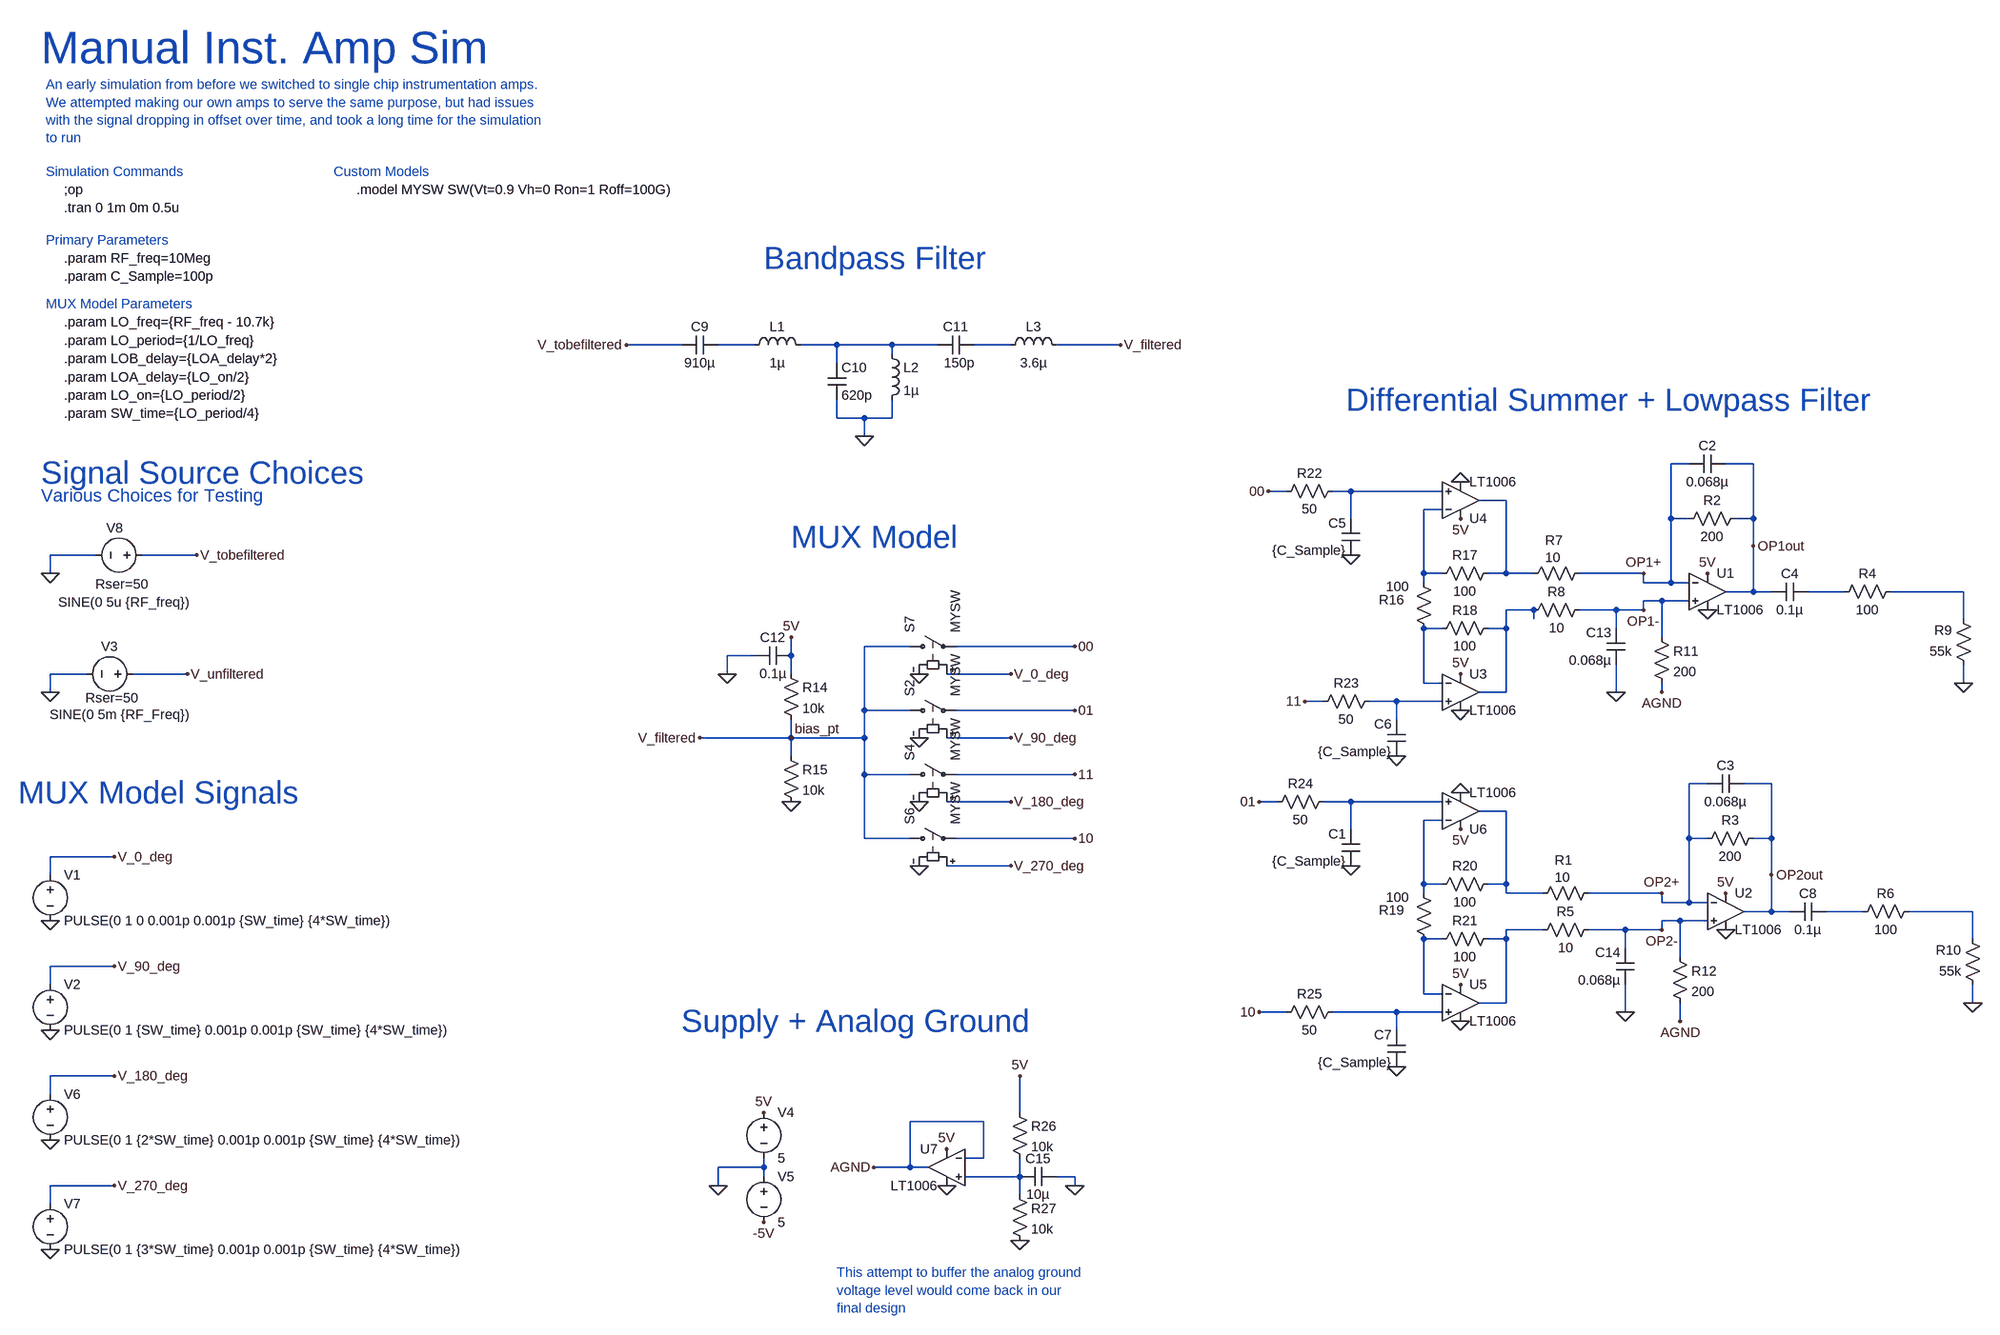
[diagram p0: schematic OldReceiverDesign.asc]
OldReceiverDesign.asc, the LTspice schematic file:
Version 4
SHEET 1 2720 2156
WIRE -192 -752 -288 -752
WIRE -64 -752 -128 -752
WIRE 80 -752 16 -752
WIRE 176 -752 80 -752
WIRE 256 -752 176 -752
WIRE 384 -752 320 -752
WIRE 576 -752 464 -752
WIRE 176 -736 176 -752
WIRE 80 -720 80 -752
WIRE 80 -624 80 -656
WIRE 128 -624 80 -624
WIRE 176 -624 176 -656
WIRE 176 -624 128 -624
WIRE 128 -592 128 -624
WIRE 1664 -544 1632 -544
WIRE 1776 -544 1728 -544
WIRE 960 -496 928 -496
WIRE 1072 -496 1040 -496
WIRE 1232 -496 1072 -496
WIRE 1344 -480 1296 -480
WIRE 1232 -464 1200 -464
WIRE 1072 -448 1072 -496
WIRE 1632 -448 1632 -544
WIRE 1664 -448 1632 -448
WIRE 1776 -448 1776 -544
WIRE 1776 -448 1744 -448
WIRE 1776 -400 1776 -448
WIRE -1216 -384 -1296 -384
WIRE -1040 -384 -1136 -384
WIRE -1296 -352 -1296 -384
WIRE 1200 -352 1200 -464
WIRE 1232 -352 1200 -352
WIRE 1344 -352 1344 -480
WIRE 1344 -352 1312 -352
WIRE 1392 -352 1344 -352
WIRE 1584 -352 1472 -352
WIRE 1200 -336 1200 -352
WIRE 1584 -336 1584 -352
WIRE 1632 -336 1632 -448
WIRE 1632 -336 1584 -336
WIRE 1664 -336 1632 -336
WIRE 1776 -320 1776 -400
WIRE 1776 -320 1728 -320
WIRE 1808 -320 1776 -320
WIRE 1936 -320 1872 -320
WIRE 2144 -320 2016 -320
WIRE 1616 -304 1584 -304
WIRE 1664 -304 1616 -304
WIRE 1392 -288 1344 -288
WIRE 1536 -288 1472 -288
WIRE 1584 -288 1584 -304
WIRE 1584 -288 1536 -288
WIRE 1392 -272 1392 -288
WIRE 2144 -272 2144 -320
WIRE 1232 -256 1200 -256
WIRE 1344 -256 1344 -288
WIRE 1344 -256 1312 -256
WIRE 1536 -256 1536 -288
WIRE 1616 -240 1616 -304
WIRE 208 -224 128 -224
WIRE 496 -224 288 -224
WIRE -64 -208 -112 -208
WIRE 0 -208 0 -240
WIRE -1232 -176 -1296 -176
WIRE -1056 -176 -1152 -176
WIRE -112 -176 -112 -208
WIRE 0 -176 0 -208
WIRE 384 -176 272 -176
WIRE 1200 -160 1200 -256
WIRE 1232 -160 1200 -160
WIRE 2144 -160 2144 -192
WIRE -1296 -144 -1296 -176
WIRE 1344 -144 1344 -256
WIRE 1344 -144 1296 -144
WIRE 1536 -144 1536 -192
WIRE 1616 -144 1616 -160
WIRE 1024 -128 992 -128
WIRE 1152 -128 1104 -128
WIRE 1232 -128 1152 -128
WIRE 128 -112 128 -224
WIRE 208 -112 128 -112
WIRE 496 -112 288 -112
WIRE 1152 -96 1152 -128
WIRE 0 -64 0 -96
WIRE 0 -64 -160 -64
WIRE 128 -64 128 -112
WIRE 128 -64 0 -64
WIRE 384 -64 272 -64
WIRE 0 -32 0 -64
WIRE 128 0 128 -64
WIRE 208 0 128 0
WIRE 496 0 288 0
WIRE 1696 16 1664 16
WIRE 1808 16 1760 16
WIRE 384 48 272 48
WIRE 944 48 912 48
WIRE 1072 48 1024 48
WIRE 1232 48 1072 48
WIRE 1344 64 1296 64
WIRE 1232 80 1200 80
WIRE 1072 96 1072 48
WIRE 128 112 128 0
WIRE 208 112 128 112
WIRE 496 112 288 112
WIRE 1664 112 1664 16
WIRE 1696 112 1664 112
WIRE 1808 112 1808 16
WIRE 1808 112 1776 112
WIRE -1184 144 -1296 144
WIRE 384 160 272 160
WIRE -1296 176 -1296 144
WIRE 1808 176 1808 112
WIRE 1200 192 1200 80
WIRE 1232 192 1200 192
WIRE 1344 192 1344 64
WIRE 1344 192 1312 192
WIRE 1200 208 1200 192
WIRE 1344 208 1344 192
WIRE 1408 208 1344 208
WIRE 1616 208 1488 208
WIRE 1616 224 1616 208
WIRE 1664 224 1664 112
WIRE 1664 224 1616 224
WIRE 1696 224 1664 224
WIRE 1808 240 1808 176
WIRE 1808 240 1760 240
WIRE 1840 240 1808 240
WIRE 1968 240 1904 240
WIRE 2160 240 2048 240
WIRE 1648 256 1616 256
WIRE 1696 256 1648 256
WIRE 1408 272 1344 272
WIRE 1552 272 1488 272
WIRE 1616 272 1616 256
WIRE 1616 272 1552 272
WIRE 1232 288 1200 288
WIRE 1344 288 1344 272
WIRE 1344 288 1312 288
WIRE 2160 288 2160 240
WIRE 1552 304 1552 272
WIRE 1648 320 1648 256
WIRE -1184 336 -1296 336
WIRE -1296 368 -1296 336
WIRE 1200 384 1200 288
WIRE 1232 384 1200 384
WIRE 1344 400 1344 288
WIRE 1344 400 1296 400
WIRE 2160 400 2160 368
WIRE 960 416 912 416
WIRE 1152 416 1040 416
WIRE 1232 416 1152 416
WIRE 1552 416 1552 368
WIRE 1648 432 1648 400
WIRE 1152 448 1152 416
WIRE -1184 528 -1296 528
WIRE -1296 560 -1296 528
WIRE 400 592 400 528
WIRE 336 608 208 608
WIRE 336 672 336 608
WIRE 336 672 304 672
WIRE -48 688 -48 672
WIRE -48 688 -128 688
WIRE 208 688 208 608
WIRE 208 688 144 688
WIRE 240 688 208 688
WIRE -48 704 -48 688
WIRE 400 704 400 672
WIRE 400 704 304 704
WIRE 496 704 464 704
WIRE -1184 720 -1296 720
WIRE -128 720 -128 688
WIRE 496 720 496 704
WIRE 400 736 400 704
WIRE -1296 752 -1296 720
FLAG 224 -176 0
FLAG 224 -64 0
FLAG 224 48 0
FLAG 224 160 0
FLAG -1296 -144 0
FLAG -48 592 5V
FLAG 1152 -32 0
FLAG 1072 -384 0
FLAG 1584 -352 OP1+
FLAG 1616 272 OP2-
FLAG 1584 -288 OP1-
FLAG 1776 -400 OP1out
FLAG 1808 176 OP2out
FLAG 1616 208 OP2+
FLAG 2144 -160 0
FLAG 2160 400 0
FLAG -128 720 0
FLAG -48 784 -5V
FLAG 384 -176 V_0_deg
FLAG 384 -64 V_90_deg
FLAG 384 48 V_180_deg
FLAG 384 160 V_270_deg
FLAG -1296 256 0
FLAG -1184 144 V_0_deg
FLAG -1296 448 0
FLAG -1184 336 V_90_deg
FLAG -1296 640 0
FLAG -1184 528 V_180_deg
FLAG -1296 832 0
FLAG -1184 720 V_270_deg
FLAG 496 -224 00
FLAG 496 0 11
FLAG 928 -496 00
FLAG 992 -128 11
FLAG -1296 -352 0
FLAG 128 -592 0
FLAG 576 -752 V_filtered
FLAG -1056 -176 V_unfiltered
FLAG -160 -64 V_filtered
FLAG 0 -240 5V
FLAG 0 48 0
FLAG 0 -64 bias_pt
FLAG -112 -176 0
FLAG 1696 -288 0
FLAG 1696 -352 5V
FLAG 1264 -448 5V
FLAG 1264 -512 0
FLAG 1264 -112 0
FLAG 1264 -176 5V
FLAG 1152 512 0
FLAG 1072 160 0
FLAG 912 48 01
FLAG 912 416 10
FLAG 1264 96 5V
FLAG 1264 32 0
FLAG 1264 432 0
FLAG 1264 368 5V
FLAG 496 -112 01
FLAG 496 112 10
FLAG 1536 -144 0
FLAG 1552 416 0
FLAG 1728 272 0
FLAG 1728 208 5V
FLAG 400 528 5V
FLAG 400 816 0
FLAG 496 720 0
FLAG 144 688 AGND
FLAG 1616 -144 AGND
FLAG 1648 432 AGND
FLAG 272 720 0
FLAG 272 656 5V
FLAG -1040 -384 V_tobefiltered
FLAG -288 -752 V_tobefiltered
SYMBOL sw 192 -224 R270
SYMATTR InstName S7
SYMATTR Value MYSW
SYMBOL sw 192 -112 R270
SYMATTR InstName S2
SYMATTR Value MYSW
SYMBOL sw 192 0 R270
SYMATTR InstName S4
SYMATTR Value MYSW
SYMBOL sw 192 112 R270
SYMATTR InstName S6
SYMATTR Value MYSW
SYMBOL voltage -1136 -176 R90
WINDOW 0 -32 56 VBottom 2
WINDOW 3 56 38 VTop 2
WINDOW 123 0 0 Left 0
WINDOW 39 58 52 VBottom 2
SYMATTR InstName V3
SYMATTR Value SINE(0 5m {RF_Freq})
SYMATTR SpiceLine Rser=50
SYMBOL voltage -48 576 R0
WINDOW 123 0 0 Left 0
WINDOW 39 0 0 Left 0
SYMATTR InstName V4
SYMATTR Value 5
SYMBOL cap 1088 -384 R180
WINDOW 0 24 56 Left 2
WINDOW 3 24 8 Left 2
SYMATTR InstName C5
SYMATTR Value {C_Sample}
SYMBOL cap 1168 -32 R180
WINDOW 0 24 56 Left 2
WINDOW 3 24 8 Left 2
SYMATTR InstName C6
SYMATTR Value {C_Sample}
SYMBOL res 1376 -336 R270
WINDOW 0 58 52 VTop 2
WINDOW 3 59 50 VBottom 2
SYMATTR InstName R7
SYMATTR Value 10
SYMBOL res 1488 -304 R90
WINDOW 0 0 56 VBottom 2
WINDOW 3 32 56 VTop 2
SYMATTR InstName R8
SYMATTR Value 10
SYMBOL res 1760 -464 R90
WINDOW 0 0 56 VBottom 2
WINDOW 3 32 56 VTop 2
SYMATTR InstName R2
SYMATTR Value 200
SYMBOL cap 1728 -560 R90
WINDOW 0 0 32 VBottom 2
WINDOW 3 32 32 VTop 2
SYMATTR InstName C2
SYMATTR Value 0.068µ
SYMBOL res 1792 96 R90
WINDOW 0 0 56 VBottom 2
WINDOW 3 32 56 VTop 2
SYMATTR InstName R3
SYMATTR Value 200
SYMBOL cap 1760 0 R90
WINDOW 0 0 32 VBottom 2
WINDOW 3 32 32 VTop 2
SYMATTR InstName C3
SYMATTR Value 0.068µ
SYMBOL cap 1872 -336 R90
WINDOW 0 0 32 VBottom 2
WINDOW 3 32 32 VTop 2
SYMATTR InstName C4
SYMATTR Value 0.1µ
SYMBOL cap 1904 224 R90
WINDOW 0 0 32 VBottom 2
WINDOW 3 32 32 VTop 2
SYMATTR InstName C8
SYMATTR Value 0.1µ
SYMBOL res 2032 -336 R90
WINDOW 0 0 56 VBottom 2
WINDOW 3 32 56 VTop 2
SYMATTR InstName R4
SYMATTR Value 100
SYMBOL res 2064 224 R90
WINDOW 0 0 56 VBottom 2
WINDOW 3 32 56 VTop 2
SYMATTR InstName R6
SYMATTR Value 100
SYMBOL res 2160 -176 R180
WINDOW 0 36 76 Left 2
WINDOW 3 36 40 Left 2
SYMATTR InstName R9
SYMATTR Value 55k
SYMBOL res 2176 384 R180
WINDOW 0 36 76 Left 2
WINDOW 3 36 40 Left 2
SYMATTR InstName R10
SYMATTR Value 55k
SYMBOL voltage -48 688 R0
WINDOW 123 0 0 Left 0
WINDOW 39 0 0 Left 0
SYMATTR InstName V5
SYMATTR Value 5
SYMBOL res 1600 -256 R0
SYMATTR InstName R11
SYMATTR Value 200
SYMBOL res 1632 304 R0
SYMATTR InstName R12
SYMATTR Value 200
SYMBOL voltage -1296 160 R0
WINDOW 123 0 0 Left 0
WINDOW 39 0 0 Left 0
SYMATTR InstName V1
SYMATTR Value PULSE(0 1 0 0.001p 0.001p {SW_time} {4*SW_time})
SYMBOL voltage -1296 352 R0
WINDOW 123 0 0 Left 0
WINDOW 39 0 0 Left 0
SYMATTR InstName V2
SYMATTR Value PULSE(0 1 {SW_time} 0.001p 0.001p {SW_time} {4*SW_time})
SYMBOL voltage -1296 544 R0
WINDOW 123 0 0 Left 0
WINDOW 39 0 0 Left 0
SYMATTR InstName V6
SYMATTR Value PULSE(0 1 {2*SW_time} 0.001p 0.001p {SW_time} {4*SW_time})
SYMBOL voltage -1296 736 R0
WINDOW 123 0 0 Left 0
WINDOW 39 0 0 Left 0
SYMATTR InstName V7
SYMATTR Value PULSE(0 1 {3*SW_time} 0.001p 0.001p {SW_time} {4*SW_time})
SYMBOL voltage -1120 -384 R90
WINDOW 0 -63 63 VTop 2
WINDOW 3 67 47 VTop 2
WINDOW 123 0 0 Left 0
WINDOW 39 35 51 VTop 2
SYMATTR InstName V8
SYMATTR Value SINE(0 5u {RF_freq})
SYMATTR SpiceLine Rser=50
SYMBOL cap -128 -768 R90
WINDOW 0 0 32 VBottom 2
WINDOW 3 32 32 VTop 2
SYMATTR InstName C9
SYMATTR Value 910µ
SYMBOL ind -80 -736 R270
WINDOW 0 32 56 VTop 2
WINDOW 3 0 56 VBottom 2
SYMATTR InstName L1
SYMATTR Value 1µ
SYMBOL cap 64 -720 R0
SYMATTR InstName C10
SYMATTR Value 620p
SYMBOL ind 160 -752 R0
SYMATTR InstName L2
SYMATTR Value 1µ
SYMBOL cap 320 -768 R90
WINDOW 0 0 32 VBottom 2
WINDOW 3 32 26 VTop 2
SYMATTR InstName C11
SYMATTR Value 150p
SYMBOL ind 368 -736 R270
WINDOW 0 32 56 VTop 2
WINDOW 3 0 56 VBottom 2
SYMATTR InstName L3
SYMATTR Value 3.6µ
SYMBOL res -16 -192 R0
SYMATTR InstName R14
SYMATTR Value 10k
SYMBOL res -16 -48 R0
SYMATTR InstName R15
SYMATTR Value 10k
SYMBOL cap 0 -224 R90
WINDOW 0 0 32 VBottom 2
WINDOW 3 32 32 VTop 2
SYMATTR InstName C12
SYMATTR Value 0.1µ
SYMBOL Opamps\\LT1006 1696 -384 R0
SYMATTR InstName U1
SYMBOL Opamps\\LT1006 1264 -208 R0
SYMATTR InstName U3
SYMBOL Opamps\\LT1006 1264 -416 M180
SYMATTR InstName U4
SYMBOL res 1184 -352 R0
WINDOW 0 -63 46 Left 2
WINDOW 3 -50 23 Left 2
SYMATTR InstName R16
SYMATTR Value 100
SYMBOL res 1328 -368 R90
WINDOW 0 0 56 VBottom 2
WINDOW 3 32 56 VTop 2
SYMATTR InstName R17
SYMATTR Value 100
SYMBOL res 1328 -272 R90
WINDOW 0 0 56 VBottom 2
WINDOW 3 32 56 VTop 2
SYMATTR InstName R18
SYMATTR Value 100
SYMBOL cap 1088 160 R180
WINDOW 0 24 56 Left 2
WINDOW 3 24 8 Left 2
SYMATTR InstName C1
SYMATTR Value {C_Sample}
SYMBOL cap 1168 512 R180
WINDOW 0 24 56 Left 2
WINDOW 3 24 8 Left 2
SYMATTR InstName C7
SYMATTR Value {C_Sample}
SYMBOL Opamps\\LT1006 1264 336 R0
SYMATTR InstName U5
SYMBOL Opamps\\LT1006 1264 128 M180
SYMATTR InstName U6
SYMBOL res 1184 192 R0
WINDOW 0 -63 46 Left 2
WINDOW 3 -50 23 Left 2
SYMATTR InstName R19
SYMATTR Value 100
SYMBOL res 1328 176 R90
WINDOW 0 0 56 VBottom 2
WINDOW 3 32 56 VTop 2
SYMATTR InstName R20
SYMATTR Value 100
SYMBOL res 1328 272 R90
WINDOW 0 0 56 VBottom 2
WINDOW 3 32 56 VTop 2
SYMATTR InstName R21
SYMATTR Value 100
SYMBOL cap 1552 -192 R180
WINDOW 0 24 56 Left 2
WINDOW 3 24 8 Left 2
SYMATTR InstName C13
SYMATTR Value 0.068µ
SYMBOL res 1392 224 R270
WINDOW 0 58 52 VTop 2
WINDOW 3 59 50 VBottom 2
SYMATTR InstName R1
SYMATTR Value 10
SYMBOL res 1504 256 R90
WINDOW 0 0 56 VBottom 2
WINDOW 3 32 56 VTop 2
SYMATTR InstName R5
SYMATTR Value 10
SYMBOL cap 1568 368 R180
WINDOW 0 24 56 Left 2
WINDOW 3 24 8 Left 2
SYMATTR InstName C14
SYMATTR Value 0.068µ
SYMBOL res 1056 -512 R90
WINDOW 0 0 56 VBottom 2
WINDOW 3 32 56 VTop 2
SYMATTR InstName R22
SYMATTR Value 50
SYMBOL res 1120 -144 R90
WINDOW 0 0 56 VBottom 2
WINDOW 3 32 56 VTop 2
SYMATTR InstName R23
SYMATTR Value 50
SYMBOL res 1040 32 R90
WINDOW 0 0 56 VBottom 2
WINDOW 3 32 56 VTop 2
SYMATTR InstName R24
SYMATTR Value 50
SYMBOL res 1056 400 R90
WINDOW 0 0 56 VBottom 2
WINDOW 3 32 56 VTop 2
SYMATTR InstName R25
SYMATTR Value 50
SYMBOL Opamps\\LT1006 1728 176 R0
SYMATTR InstName U2
SYMBOL res 384 576 R0
SYMATTR InstName R26
SYMATTR Value 10k
SYMBOL res 384 720 R0
SYMATTR InstName R27
SYMATTR Value 10k
SYMBOL cap 400 720 R270
WINDOW 0 32 32 VTop 2
WINDOW 3 0 32 VBottom 2
SYMATTR InstName C15
SYMATTR Value 10µ
SYMBOL Opamps\\LT1006 272 624 M0
SYMATTR InstName U7
TEXT -1312 -1272 Left 6 ;Manual Inst. Amp Sim
TEXT -1312 -528 Left 5 ;Signal Source Choices
TEXT -1352 32 Left 5 ;MUX Model Signals
TEXT -48 -904 Left 5 ;Bandpass Filter
TEXT 0 -416 Left 5 ;MUX Model
TEXT -192 432 Left 5 ;Supply + Analog Ground
TEXT -1272 -992 Left 2 !.tran 0 1m 0m 0.5u
TEXT -1272 -904 Left 2 !.param RF_freq=10Meg
TEXT -1272 -1024 Left 2 !;op
TEXT -1272 -872 Left 2 !.param C_Sample=100p
TEXT -1272 -792 Left 2 !.param LO_freq={RF_freq - 10.7k}
TEXT -1272 -760 Left 2 !.param LO_period={1/LO_freq}
TEXT -1272 -728 Left 2 !.param LOB_delay={LOA_delay*2}
TEXT -1272 -696 Left 2 !.param LOA_delay={LO_on/2}
TEXT -1272 -664 Left 2 !.param LO_on={LO_period/2}
TEXT -1272 -632 Left 2 !.param SW_time={LO_period/4}
TEXT -1304 -936 Left 2 ;Primary Parameters
TEXT -1304 -824 Left 2 ;MUX Model Parameters
TEXT -1304 -1056 Left 2 ;Simulation Commands
TEXT -760 -1024 Left 2 !.model MYSW SW(Vt=0.9 Vh=0 Ron=1 Roff=100G)
TEXT -800 -1056 Left 2 ;Custom Models
TEXT -1312 -488 Left 3 ;Various Choices for Testing
TEXT 1064 -656 Left 5 ;Differential Summer + Lowpass Filter
TEXT -1304 -1208 Left 2 ;An early simulation from before we switched to single chip instrumentation amps.\nWe attempted making our own amps to serve the same purpose, but had issues \nwith the signal dropping in offset over time, and took a long time for the simulation\nto run
TEXT 80 872 Left 2 ;This attempt to buffer the analog ground\nvoltage level would come back in our\nfinal design

The netlist it stands for:
* OldReceiverDesign.asc
S7 bias_pt 00 V_0_deg 0 MYSW
S2 bias_pt 01 V_90_deg 0 MYSW
S4 bias_pt 11 V_180_deg 0 MYSW
S6 bias_pt 10 V_270_deg 0 MYSW
V3 V_unfiltered 0 SINE(0 5m {RF_Freq}) Rser=50
V4 5V 0 5
C5 0 N004 {C_Sample}
C6 0 N011 {C_Sample}
R7 N005 OP1+ 10
R8 OP1- N009 10
R2 OP1out OP1+ 200
C2 OP1out OP1+ 0.068µ
R3 OP2out OP2+ 200
C3 OP2out OP2+ 0.068µ
C4 N007 OP1out 0.1µ
C8 N015 OP2out 0.1µ
R4 N008 N007 100
R6 N016 N015 100
R9 0 N008 55k
R10 0 N016 55k
V5 0 -5V 5
R11 OP1- AGND 200
R12 OP2- AGND 200
V1 V_0_deg 0 PULSE(0 1 0 0.001p 0.001p {SW_time} {4*SW_time})
V2 V_90_deg 0 PULSE(0 1 {SW_time} 0.001p 0.001p {SW_time} {4*SW_time})
V6 V_180_deg 0 PULSE(0 1 {2*SW_time} 0.001p 0.001p {SW_time} {4*SW_time})
V7 V_270_deg 0 PULSE(0 1 {3*SW_time} 0.001p 0.001p {SW_time} {4*SW_time})
V8 V_tobefiltered 0 SINE(0 5u {RF_freq}) Rser=50
C9 N001 V_tobefiltered 910µ
L1 N001 N002 1µ
C10 N002 0 620p
L2 N002 0 1µ
C11 N003 N002 150p
L3 N003 bias_pt 3.6µ
R14 5V bias_pt 10k
R15 bias_pt 0 10k
C12 5V 0 0.1µ
XU1 OP1- OP1+ 5V 0 OP1out LT1006  ; pins In+ In- V+ V- OUT
XU3 N011 N010 5V 0 N009 LT1006  ; pins In+ In- V+ V- OUT
XU4 N004 N006 5V 0 N005 LT1006  ; pins In+ In- V+ V- OUT
R16 N006 N010 100
R17 N005 N006 100
R18 N009 N010 100
C1 0 N012 {C_Sample}
C7 0 N019 {C_Sample}
XU5 N019 N018 5V 0 N017 LT1006  ; pins In+ In- V+ V- OUT
XU6 N012 N014 5V 0 N013 LT1006  ; pins In+ In- V+ V- OUT
R19 N014 N018 100
R20 N013 N014 100
R21 N017 N018 100
C13 0 OP1- 0.068µ
R1 N013 OP2+ 10
R5 OP2- N017 10
C14 0 OP2- 0.068µ
R22 N004 00 50
R23 N011 11 50
R24 N012 01 50
R25 N019 10 50
XU2 OP2- OP2+ 5V 0 OP2out LT1006  ; pins In+ In- V+ V- OUT
R26 5V N020 10k
R27 N020 0 10k
C15 N020 0 10µ
XU7 N020 AGND 5V 0 AGND LT1006  ; pins In+ In- V+ V- OUT
* Manual Inst. Amp Sim
* Signal Source Choices
* MUX Model Signals
* Bandpass Filter
* MUX Model
* Supply + Analog Ground
.tran 0 1m 0m 0.5u
.param RF_freq=10Meg
;op
.param C_Sample=100p
.param LO_freq={RF_freq - 10.7k}
.param LO_period={1/LO_freq}
.param LOB_delay={LOA_delay*2}
.param LOA_delay={LO_on/2}
.param LO_on={LO_period/2}
.param SW_time={LO_period/4}
* Primary Parameters
* MUX Model Parameters
* Simulation Commands
.model MYSW SW(Vt=0.9 Vh=0 Ron=1 Roff=100G)
* Custom Models
* Various Choices for Testing
* Differential Summer + Lowpass Filter
* An early simulation from before we switched to single chip instrumentation amps.
* We attempted making our own amps to serve the same purpose, but had issues
* with the signal dropping in offset over time, and took a long time for the simulation
* to run
* This attempt to buffer the analog ground
* voltage level would come back in our
* final design
.lib LTC.lib
.backanno
.end